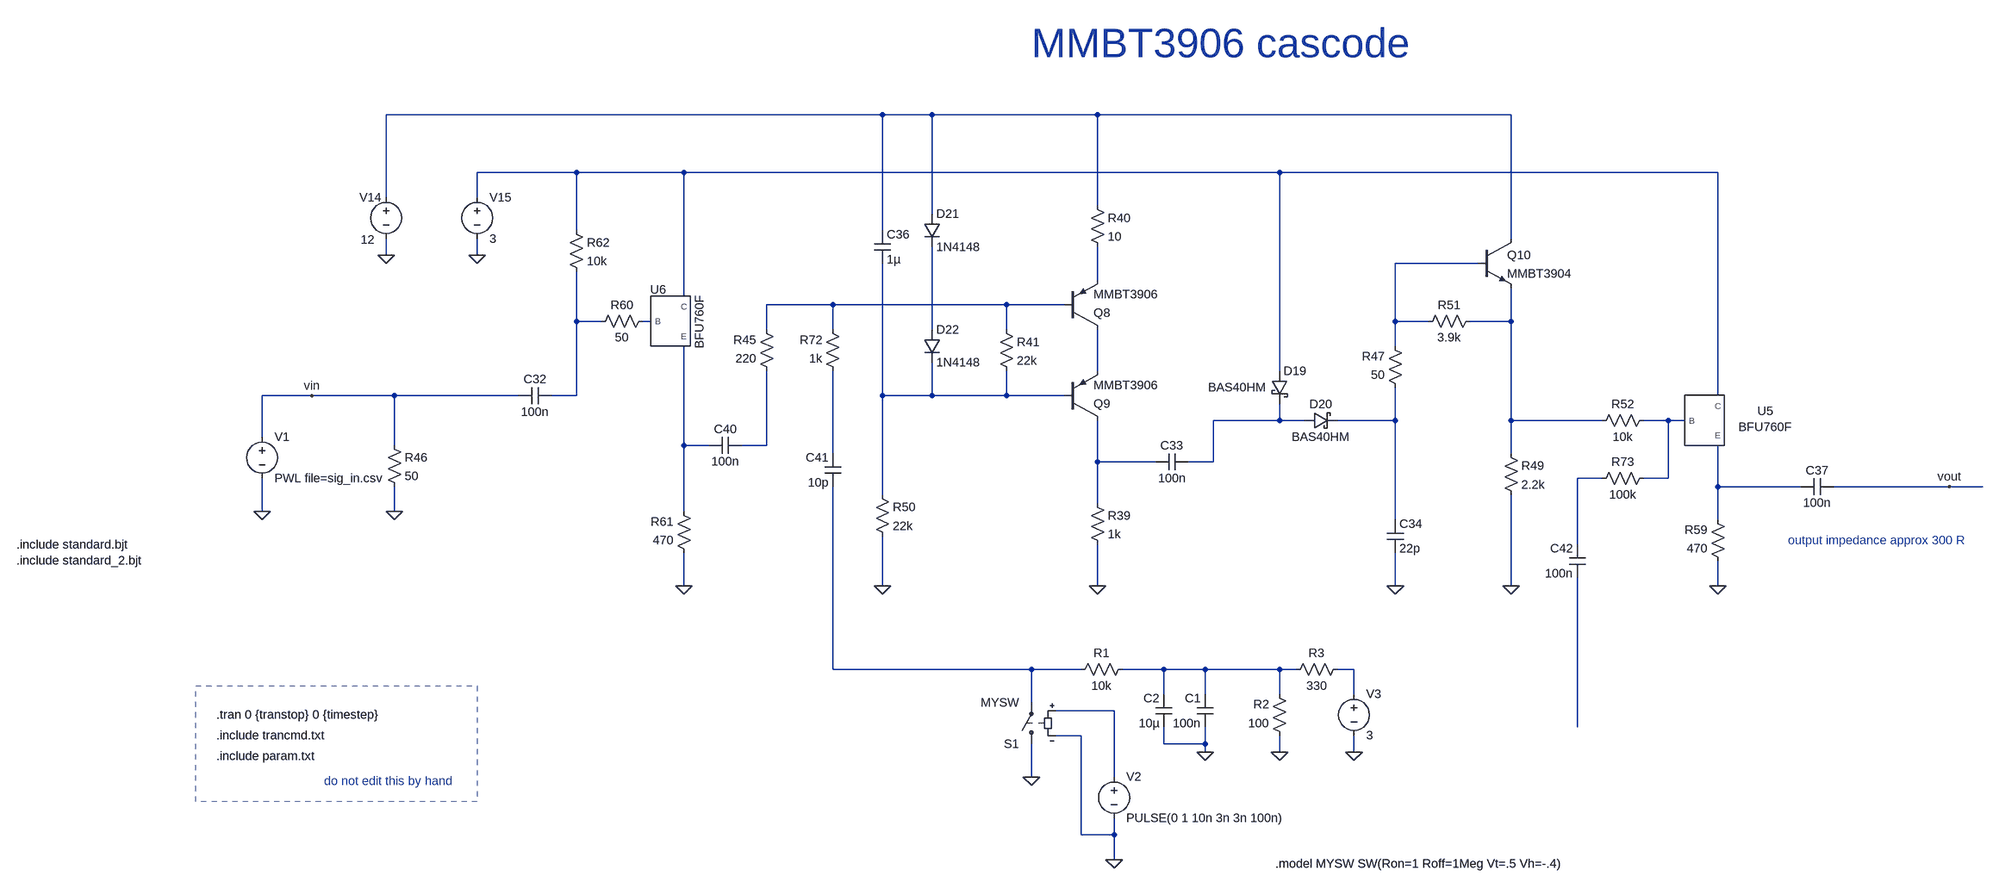
[diagram p0: schematic 3906_casc_kickstart.asc]
3906_casc_kickstart.asc, the LTspice schematic file:
Version 4
SHEET 1 25452 10420
WIRE 19296 3648 18336 3648
WIRE 19392 3648 19296 3648
WIRE 19712 3648 19392 3648
WIRE 20512 3648 19712 3648
WIRE 18704 3760 18512 3760
WIRE 18912 3760 18704 3760
WIRE 20064 3760 18912 3760
WIRE 20912 3760 20064 3760
WIRE 18336 3808 18336 3648
WIRE 18512 3808 18512 3760
WIRE 19712 3824 19712 3648
WIRE 19392 3840 19392 3648
WIRE 18704 3872 18704 3760
WIRE 19296 3872 19296 3648
WIRE 20512 3888 20512 3648
WIRE 18336 3920 18336 3888
WIRE 18512 3920 18512 3888
WIRE 20448 3936 20288 3936
WIRE 19712 3968 19712 3904
WIRE 18912 4000 18912 3760
WIRE 19200 4016 19072 4016
WIRE 19536 4016 19200 4016
WIRE 19648 4016 19536 4016
WIRE 18704 4048 18704 3952
WIRE 18752 4048 18704 4048
WIRE 18848 4048 18832 4048
WIRE 20288 4048 20288 3936
WIRE 20352 4048 20288 4048
WIRE 20512 4048 20512 3984
WIRE 20512 4048 20432 4048
WIRE 19072 4064 19072 4016
WIRE 19200 4064 19200 4016
WIRE 19392 4064 19392 3904
WIRE 19536 4064 19536 4016
WIRE 20288 4096 20288 4048
WIRE 19712 4144 19712 4064
WIRE 20064 4144 20064 3760
WIRE 18192 4192 18096 4192
WIRE 18352 4192 18192 4192
WIRE 18592 4192 18352 4192
WIRE 18704 4192 18704 4048
WIRE 18704 4192 18656 4192
WIRE 19296 4192 19296 3936
WIRE 19392 4192 19392 4128
WIRE 19392 4192 19296 4192
WIRE 19536 4192 19536 4144
WIRE 19536 4192 19392 4192
WIRE 19648 4192 19536 4192
WIRE 20912 4192 20912 3760
WIRE 20064 4240 20064 4208
WIRE 20064 4240 19936 4240
WIRE 20112 4240 20064 4240
WIRE 20288 4240 20288 4176
WIRE 20288 4240 20176 4240
WIRE 20512 4240 20512 4048
WIRE 20688 4240 20512 4240
WIRE 20816 4240 20768 4240
WIRE 20848 4240 20816 4240
WIRE 18096 4272 18096 4192
WIRE 18352 4288 18352 4192
WIRE 18912 4288 18912 4096
WIRE 18960 4288 18912 4288
WIRE 19072 4288 19072 4144
WIRE 19072 4288 19024 4288
WIRE 19200 4304 19200 4144
WIRE 20512 4304 20512 4240
WIRE 19712 4320 19712 4240
WIRE 19824 4320 19712 4320
WIRE 19936 4320 19936 4240
WIRE 19936 4320 19888 4320
WIRE 20688 4352 20640 4352
WIRE 20816 4352 20816 4240
WIRE 20816 4352 20768 4352
WIRE 20912 4368 20912 4288
WIRE 21072 4368 20912 4368
WIRE 21360 4368 21136 4368
WIRE 21424 4368 21360 4368
WIRE 19296 4384 19296 4192
WIRE 19712 4400 19712 4320
WIRE 18096 4416 18096 4352
WIRE 18352 4416 18352 4368
WIRE 18912 4416 18912 4288
WIRE 20288 4432 20288 4240
WIRE 20912 4432 20912 4368
WIRE 20640 4480 20640 4352
WIRE 18912 4560 18912 4496
WIRE 19296 4560 19296 4464
WIRE 19712 4560 19712 4480
WIRE 20288 4560 20288 4496
WIRE 20512 4560 20512 4384
WIRE 20912 4560 20912 4512
WIRE 19200 4800 19200 4368
WIRE 19584 4800 19200 4800
WIRE 19680 4800 19584 4800
WIRE 19840 4800 19760 4800
WIRE 19920 4800 19840 4800
WIRE 20064 4800 19920 4800
WIRE 20096 4800 20064 4800
WIRE 20208 4800 20176 4800
WIRE 19840 4848 19840 4800
WIRE 19920 4848 19920 4800
WIRE 20064 4848 20064 4800
WIRE 20208 4848 20208 4800
WIRE 19584 4864 19584 4800
WIRE 19744 4880 19632 4880
WIRE 20640 4912 20640 4544
WIRE 19680 4928 19632 4928
WIRE 19840 4944 19840 4912
WIRE 19920 4944 19920 4912
WIRE 19920 4944 19840 4944
WIRE 19920 4960 19920 4944
WIRE 20064 4960 20064 4928
WIRE 20208 4960 20208 4928
WIRE 19584 5008 19584 4944
WIRE 19744 5008 19744 4880
WIRE 19680 5120 19680 4928
WIRE 19744 5120 19744 5088
WIRE 19744 5120 19680 5120
WIRE 19744 5168 19744 5120
FLAG 19712 4560 0
FLAG 18352 4416 0
FLAG 20288 4560 0
FLAG 19296 4560 0
FLAG 20512 4560 0
FLAG 20912 4560 0
FLAG 18512 3920 0
FLAG 18912 4560 0
FLAG 18336 3920 0
FLAG 18192 4192 vin
FLAG 18096 4416 0
FLAG 21360 4368 vout
FLAG 19584 5008 0
FLAG 19744 5168 0
FLAG 20208 4960 0
FLAG 20064 4960 0
FLAG 19920 4960 0
SYMBOL pnp 19648 4064 M180
SYMATTR InstName Q8
SYMATTR Value MMBT3906
SYMBOL pnp 19648 4240 M180
SYMATTR InstName Q9
SYMATTR Value MMBT3906
SYMBOL res 19696 4384 R0
SYMATTR InstName R39
SYMATTR Value 1k
SYMBOL res 19696 3808 R0
SYMATTR InstName R40
SYMATTR Value 10
SYMBOL voltage 18336 3792 R0
WINDOW 123 0 0 Left 2
WINDOW 39 14 99 Left 2
WINDOW 0 -52 16 Left 2
WINDOW 3 -49 98 Left 2
SYMATTR InstName V14
SYMATTR Value 12
SYMBOL res 19520 4048 R0
SYMATTR InstName R41
SYMATTR Value 22k
SYMBOL res 19088 4160 R180
WINDOW 0 36 76 Left 2
WINDOW 3 36 40 Left 2
SYMATTR InstName R45
SYMATTR Value 220
SYMBOL res 18336 4272 R0
SYMATTR InstName R46
SYMATTR Value 50
SYMBOL cap 18656 4176 R90
WINDOW 0 0 32 VBottom 2
WINDOW 3 32 32 VTop 2
SYMATTR InstName C32
SYMATTR Value 100n
SYMBOL cap 19888 4304 R90
WINDOW 0 0 32 VBottom 2
WINDOW 3 32 32 VTop 2
SYMATTR InstName C33
SYMATTR Value 100n
SYMBOL cap 20272 4432 R0
SYMATTR InstName C34
SYMATTR Value 22p
SYMBOL schottky 20048 4144 R0
WINDOW 3 -122 32 Left 2
SYMATTR Value BAS40HM
SYMATTR InstName D19
SYMATTR Description Diode
SYMATTR Type diode
SYMBOL schottky 20112 4256 R270
WINDOW 3 0 32 VBottom 2
WINDOW 0 32 32 VTop 2
SYMATTR Value BAS40HM
SYMATTR InstName D20
SYMATTR Description Diode
SYMATTR Type diode
SYMBOL res 20304 4192 R180
WINDOW 0 36 76 Left 2
WINDOW 3 36 40 Left 2
SYMATTR InstName R47
SYMATTR Value 50
SYMBOL res 20496 4288 R0
SYMATTR InstName R49
SYMATTR Value 2.2k
SYMBOL npn 20448 3888 R0
SYMATTR InstName Q10
SYMATTR Value MMBT3904
SYMBOL diode 19376 3840 R0
SYMATTR InstName D21
SYMATTR Value 1N4148
SYMBOL diode 19376 4064 R0
SYMATTR InstName D22
SYMATTR Value 1N4148
SYMBOL cap 19280 3872 R0
SYMATTR InstName C36
SYMATTR Value 1µ
SYMBOL res 19280 4368 R0
SYMATTR InstName R50
SYMATTR Value 22k
SYMBOL res 20448 4032 R90
WINDOW 0 0 56 VBottom 2
WINDOW 3 32 56 VTop 2
SYMATTR InstName R51
SYMATTR Value 3.9k
SYMBOL BFU760F 20880 4240 R0
SYMATTR InstName U5
SYMBOL res 20784 4224 R90
WINDOW 0 0 56 VBottom 2
WINDOW 3 32 56 VTop 2
SYMATTR InstName R52
SYMATTR Value 10k
SYMBOL res 20928 4528 R180
WINDOW 0 36 76 Left 2
WINDOW 3 36 40 Left 2
SYMATTR InstName R59
SYMATTR Value 470
SYMBOL cap 21136 4352 R90
WINDOW 0 0 32 VBottom 2
WINDOW 3 32 32 VTop 2
SYMATTR InstName C37
SYMATTR Value 100n
SYMBOL BFU760F 18880 4048 R0
WINDOW 0 -18 -46 Bottom 2
WINDOW 3 47 1 VTop 2
SYMATTR InstName U6
SYMBOL res 18848 4032 R90
WINDOW 0 0 56 VBottom 2
WINDOW 3 32 56 VTop 2
SYMATTR InstName R60
SYMATTR Value 50
SYMBOL res 18928 4512 R180
WINDOW 0 36 76 Left 2
WINDOW 3 36 40 Left 2
SYMATTR InstName R61
SYMATTR Value 470
SYMBOL voltage 18512 3792 R0
SYMATTR InstName V15
SYMATTR Value 3
SYMBOL cap 19024 4272 R90
WINDOW 0 0 32 VBottom 2
WINDOW 3 32 32 VTop 2
SYMATTR InstName C40
SYMATTR Value 100n
SYMBOL res 18688 3856 R0
SYMATTR InstName R62
SYMATTR Value 10k
SYMBOL res 19216 4160 R180
WINDOW 0 36 76 Left 2
WINDOW 3 36 40 Left 2
SYMATTR InstName R72
SYMATTR Value 1k
SYMBOL cap 19216 4368 R180
WINDOW 0 24 56 Left 2
WINDOW 3 24 8 Left 2
SYMATTR InstName C41
SYMATTR Value 10p
SYMBOL res 20784 4336 R90
WINDOW 0 0 56 VBottom 2
WINDOW 3 32 56 VTop 2
SYMATTR InstName R73
SYMATTR Value 100k
SYMBOL cap 20656 4544 R180
WINDOW 0 24 56 Left 2
WINDOW 3 24 8 Left 2
SYMATTR InstName C42
SYMATTR Value 100n
SYMBOL voltage 18096 4256 R0
WINDOW 39 0 0 Left 0
SYMATTR InstName V1
SYMATTR Value PWL file=sig_in.csv
SYMBOL sw 19584 4960 R180
SYMATTR InstName S1
SYMATTR Value MYSW
SYMBOL voltage 19744 4992 R0
WINDOW 123 0 0 Left 0
WINDOW 39 0 0 Left 0
SYMATTR InstName V2
SYMATTR Value PULSE(0 1 10n 3n 3n 100n)
SYMBOL res 19776 4784 R90
WINDOW 0 0 56 VBottom 2
WINDOW 3 32 56 VTop 2
SYMATTR InstName R1
SYMATTR Value 10k
SYMBOL voltage 20208 4832 R0
SYMATTR InstName V3
SYMATTR Value 3
SYMBOL res 20080 4944 R180
WINDOW 0 36 76 Left 2
WINDOW 3 36 40 Left 2
SYMATTR InstName R2
SYMATTR Value 100
SYMBOL res 20080 4816 R270
WINDOW 0 32 56 VTop 2
WINDOW 3 0 56 VBottom 2
SYMATTR InstName R3
SYMATTR Value 330
SYMBOL cap 19936 4912 R180
WINDOW 0 24 56 Left 2
WINDOW 3 24 8 Left 2
SYMATTR InstName C1
SYMATTR Value 100n
SYMBOL cap 19856 4912 R180
WINDOW 0 24 56 Left 2
WINDOW 3 24 8 Left 2
SYMATTR InstName C2
SYMATTR Value 10µ
TEXT 11056 4480 Left 2 !.include standard.bjt\n.include standard_2.bjt
TEXT 21048 4472 Left 2 ;output impedance approx 300 R
TEXT 20056 5176 Left 2 !.model MYSW SW(Ron=1 Roff=1Meg Vt=.5 Vh=-.4)
TEXT 19584 3472 Left 6 ;MMBT3906 cascode
TEXT 18008 4888 Left 2 !.tran 0 {transtop} 0 {timestep}
TEXT 18008 4968 Left 2 !.include param.txt
TEXT 18008 4928 Left 2 !.include trancmd.txt
TEXT 18216 5016 Left 2 ;do not edit this by hand
RECTANGLE Normal 18512 5056 17968 4832 2

The netlist it stands for:
* 3906_casc_kickstart.asc
Q8 N010 N005 N004 0 MMBT3906
Q9 N018 N011 N010 0 MMBT3906
R39 N018 0 1k
R40 N001 N004 10
V14 N001 0 12
R41 N005 N011 22k
R45 N016 N005 220
R46 vin 0 50
C32 N006 vin 100n
C33 N012 N018 100n
C34 N013 0 22p
D19 N002 N012 BAS40HM
D20 N012 N013 BAS40HM
R47 N013 N003 50
R49 N008 0 2.2k
Q10 N001 N003 N008 0 MMBT3904
D21 N001 N009 1N4148
D22 N009 N011 1N4148
C36 N001 N011 1µ
R50 N011 0 22k
R51 N008 N003 3.9k
XU5 N002 N014 N020 BFU760F  ; pins C B E
R52 N014 N008 10k
R59 0 N020 470
C37 vout N020 100n
XU6 N002 N007 N015 BFU760F  ; pins C B E
R60 N007 N006 50
R61 0 N015 470
V15 N002 0 3
C40 N016 N015 100n
R62 N002 N006 10k
R72 N017 N005 1k
C41 N021 N017 10p
R73 N014 N019 100k
C42 N025 N019 100n
V1 vin 0 PWL file=sig_in.csv
S1 0 N021 N024 0 MYSW
V2 N024 0 PULSE(0 1 10n 3n 3n 100n)
R1 N022 N021 10k
V3 N023 0 3
R2 0 N022 100
R3 N022 N023 330
C1 0 N022 100n
C2 0 N022 10µ
.model D D
.lib standard.dio
.model NPN NPN
.model PNP PNP
.lib standard.bjt
.include standard.bjt
.include standard_2.bjt
* output impedance approx 300 R
.model MYSW SW(Ron=1 Roff=1Meg Vt=.5 Vh=-.4)
* MMBT3906 cascode
.tran 0 {transtop} 0 {timestep}
.include param.txt
.include trancmd.txt
* do not edit this by hand
.lib BFU760F.txt
.backanno
.end